# EAGLE design data board with PD (EAGLE 9.6.2)
COMPANY: ADAFRUIT INDUSTRIES; DRAWN: LADYADA; REV: A
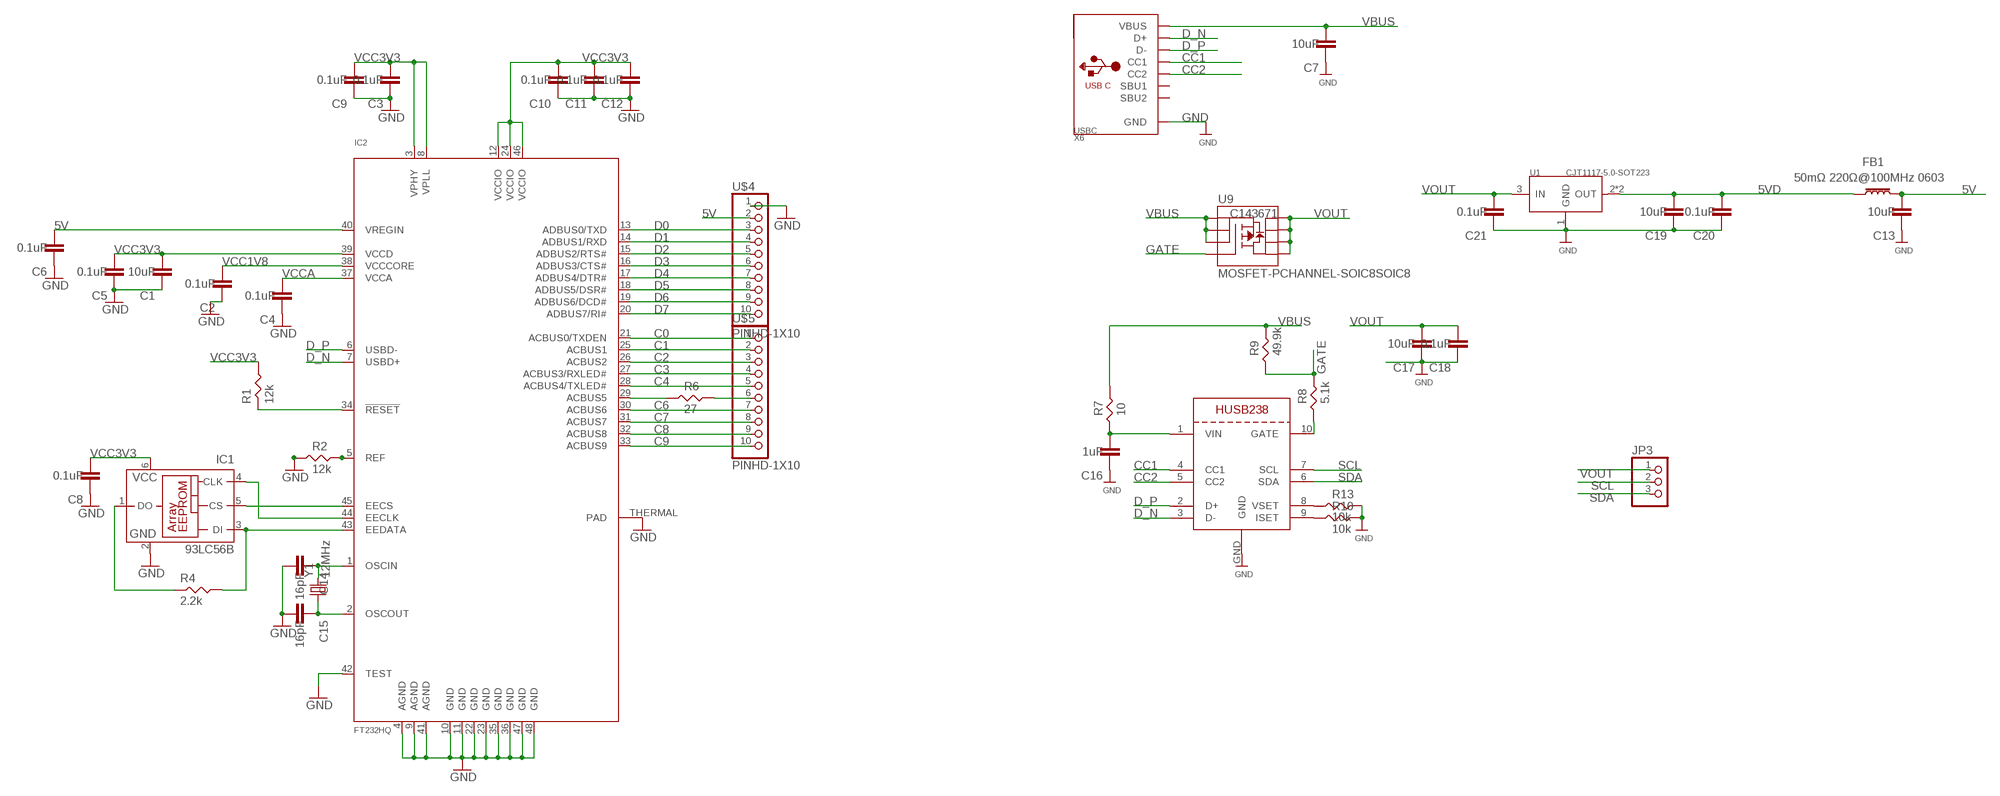
[diagram p0: schematic, sheet 1]

## Parts
C1  10uF  CAPACITOR_0805_N  [RESC0805_N]
C2  0.1uF  CAPACITOR_0402_N  [RESC0402_N]
C3  0.1uF  CAPACITOR_0402_N  [RESC0402_N]
C4  0.1uF  CAPACITOR_0402_N  [RESC0402_N]
C5  0.1uF  CAPACITOR_0402_N  [RESC0402_N]
C6  0.1uF  CAPACITOR_0402_N  [RESC0402_N]
C7  10uF  CAPACITOR_0805_N  [RESC0805_N]
C8  0.1uF  CAPACITOR_0402_N  [RESC0402_N]
C9  0.1uF  CAPACITOR_0402_N  [RESC0402_N]
C10  0.1uF  CAPACITOR_0402_N  [RESC0402_N]
C11  0.1uF  CAPACITOR_0402_N  [RESC0402_N]
C12  0.1uF  CAPACITOR_0402_N  [RESC0402_N]
C13  10uF  CAPACITOR_0805_N  [RESC0805_N]
C14  16pF  CAPACITOR_0402_N  [RESC0402_N]
C15  16pF  CAPACITOR_0402_N  [RESC0402_N]
C16  1uF  CAPACITOR_0402_N  [RESC0402_N]
C17  10uF  CAPACITOR_0805_N  [RESC0805_N]
C18  0.1uF  CAPACITOR_0402_N  [RESC0402_N]
C19  10uF  CAPACITOR_0805_N  [RESC0805_N]
C20  0.1uF  CAPACITOR_0402_N  [RESC0402_N]
C21  0.1uF  CAPACITOR_0402_N  [RESC0402_N]
FB1  50mΩ 220Ω@100MHz 0603  FERRITE_BEAD-0603  [0603]
IC1  93LC56B  93LC76A  [SOT23-6]
IC2  FT232HQ  [QFN48_8MM]
JP3  HEADER-1X3ROUND  [1X03_ROUND]
R1  12k  RES-0402  [RES-0402]
R2  12k  RES-0402  [RES-0402]
R4  2.2k  RES-0402  [RES-0402]
R6  27  RES-0402  [RES-0402]
R7  10  RES-0402  [RES-0402]
R8  5.1k  RES-0402  [RES-0402]
R9  49.9k  RES-0402  [RES-0402]
R10  10k  RES-0402  [RES-0402]
R13  10k  RES-0402  [RES-0402]
U1  CJT1117-5.0-SOT223  PMIC-CJT1117-5.0(SOT223)  [SOT-223]
U9  MOSFET-PCHANNEL-SOIC8SOIC8  [SO08]
U$4  PINHD-1X10  [1X10-BIG]
U$5  PINHD-1X10  [1X10-BIG]
X3  HUSB238  [DFN10_3X3MM]
X6  USBC  USB_C  [USB_C_CUSB31-CFM2AX-01-X]
Y1  12MHz  CRYSTALCRYSTAL-SMD-5X3-12MHZ  [CRYSTAL-SMD-5X3]

## Nets
5V [power]: C6.2 C13.2 FB1.2 IC2.40(VREGIN) U$4.2
5VD [power]: C19.2 C20.2 FB1.1 U1.2(OUT) U1.TER(OUT)
C0: IC2.21(ACBUS0/TXDEN) U$5.1
C1: IC2.25(ACBUS1) U$5.2
C2: IC2.26(ACBUS2) U$5.3
C3: IC2.27(ACBUS3/RXLED#) U$5.4
C4: IC2.28(ACBUS4/TXLED#) U$5.5
C6: IC2.30(ACBUS6) U$5.7
C7: IC2.31(ACBUS7) U$5.8
C8: IC2.32(ACBUS8) U$5.9
C9: IC2.33(ACBUS9) U$5.10
CC1: X3.4(CC1) X6.A5(CC1)
CC2: X3.5(CC2) X6.B5(CC2)
D0: IC2.13(ADBUS0/TXD) U$4.3
D1: IC2.14(ADBUS1/RXD) U$4.4
D2: IC2.15(ADBUS2/RTS#) U$4.5
D3: IC2.16(ADBUS3/CTS#) U$4.6
D4: IC2.17(ADBUS4/DTR#) U$4.7
D5: IC2.18(ADBUS5/DSR#) U$4.8
D6: IC2.19(ADBUS6/DCD#) U$4.9
D7: IC2.20(ADBUS7/RI#) U$4.10
D_N: IC2.7(USBD+) X3.3(D-) X6.A6(D+) X6.B6(D+)
D_P: IC2.6(USBD-) X3.2(D+) X6.A7(D-) X6.B7(D-)
GATE: R8.P$2 R9.P$1 U9.4(G)
GND: C1.1 C2.1 C3.1 C4.1 C5.1 C6.1 C7.1 C8.1 C9.1 C10.1 C11.1 C12.1 C13.1 C14.2 C15.2 C16.1 C17.1 C18.1 C19.1 C20.1 C21.1 IC1.2(GND) IC2.4(AGND) IC2.9(AGND) IC2.10(GND) IC2.11(GND) IC2.22(GND) IC2.23(GND) IC2.35(GND) IC2.36(GND) IC2.41(AGND) IC2.42(TEST) IC2.47(GND) IC2.48(GND) IC2.THERMAL(PAD) R2.P$1 R10.P$2 R13.P$2 U1.1(GND) U$4.1 X3.GND X6.A1B12(GND) X6.B1A12(GND)
N$1: IC2.5(REF) R2.P$2
N$2: C14.1 IC2.1(OSCIN) Y1.3
N$3: C15.1 IC2.2(OSCOUT) Y1.1
N$4: IC2.29(ACBUS5) R6.P$1
N$5: R6.P$2 U$5.6
N$6: C16.2 R7.P$1 X3.1(VIN)
N$7: IC2.34(!RESET) R1.P$1
N$8: R8.P$1 X3.10(GATE)
N$9: IC1.3(DI) IC2.43(EEDATA) R4.P$2
N$10: IC1.5(CS) IC2.45(EECS)
N$11: IC1.4(CLK) IC2.44(EECLK)
N$12: IC1.1(DO) R4.P$1
N$13: R13.P$1 X3.8(VSET)
N$14: R10.P$1 X3.9(ISET)
SCL: JP3.2 X3.7(SCL)
SDA: JP3.3 X3.6(SDA)
VBUS [power]: C7.2 R7.P$2 R9.P$2 U9.1(S) U9.2(S) U9.3(S) X6.A4B9(VBUS) X6.B4A9(VBUS)
VCC1V8: C2.2 IC2.38(VCCCORE)
VCC3V3: C1.2 C3.2 C5.2 C8.2 C9.2 C10.2 C11.2 C12.2 IC1.6(VCC) IC2.3(VPHY) IC2.8(VPLL) IC2.12(VCCIO) IC2.24(VCCIO) IC2.39(VCCD) IC2.46(VCCIO) R1.P$2
VCCA: C4.2 IC2.37(VCCA)
VOUT: C17.2 C18.2 C21.2 JP3.1 U1.3(IN) U9.5(D) U9.6(D) U9.7(D) U9.8(D)
Unconnected: X6.A8(SBU1) X6.B8(SBU2)

## Library data of the parts
C1-C21 = Nordic_nRF:CAPACITOR: Generic chip capacitor
FB1 = SparkFun-Coils:FERRITE_BEAD: Ferrite Bead (blocks, cores, rings, chokes, etc.) Inductor with layers of ferrite used to suppress high frequencies. Often used to isolate high frequency noise. SparkFun Products: IOIO-OTG - V2.2 <https://www.sparkfun.com/products/13613> SparkFun SAMD21 Mini Breakout <https://www.sparkfun.com/products/13664> SparkFun 6 Degrees of Freedom Breakout - LSM6DS3 <https://www.sparkfun.com/products/13339> SparkFun SAMD21 Dev Breakout <https://www.sparkfun.com/products/13672>; PROD_ID: NDUC-07859; VALUE: 30Ω/1.8A
IC1 = microchip:93*76?: 8K Microwire Compatible Serial EEPROM Source: http://ww1.microchip.com/downloads/en/DeviceDoc/21796H.pdf; MF: MICROCHIP; MPN: 93LC76AT-I/OT; OC_FARNELL: 1556170; OC_NEWARK: 61H6824
IC2 = microbuilder:FT232H
JP3 = microbuilder:HEADER-1X3: PIN HEADER
R1 R2 R4 R6-R10 R13 = FlashPCB_Resistors:RES-0402: https://www.digikey.com/en/products/filter/chip-resistor-surface-mount/52?s=N4IgjCBcpgbFoDGUBmBDANgZwKYBoQB7KAbRAGYBOAJgBZ4BdAgBwBcoQBlVgJwEsAdgHMQAX1EFqpEDxxY%2BWVoR4gGooA
U1 = Seeed-IC:PMIC-CJT1117-5.0(SOT223): 310030096; LCSC: C89273; MPN: CJT1117-5.0
U9 = SparkFun-DiscreteSemi:MOSFET-PCHANNEL-SOIC8: Generic 8-pin PMOSFET; LCSC: C143671
U$4 U$5 = adafruit:PINHD-1X10: Pin header 1x10 0.1" spacing With round pins
X3 = adafruit_power:HUSB238
X6 = microbuilder:USB_C: USB Type-C USB 2.0 Connector
Y1 = SparkFun-FreqCtrl:CRYSTAL: Various standard crystals. Proven footprints.; LCSC: C2901628; PROD_ID: XTAL-08297

## Net classes
1 power: width 0.305 mm
2 gnd: width 0.254 mm

## Board
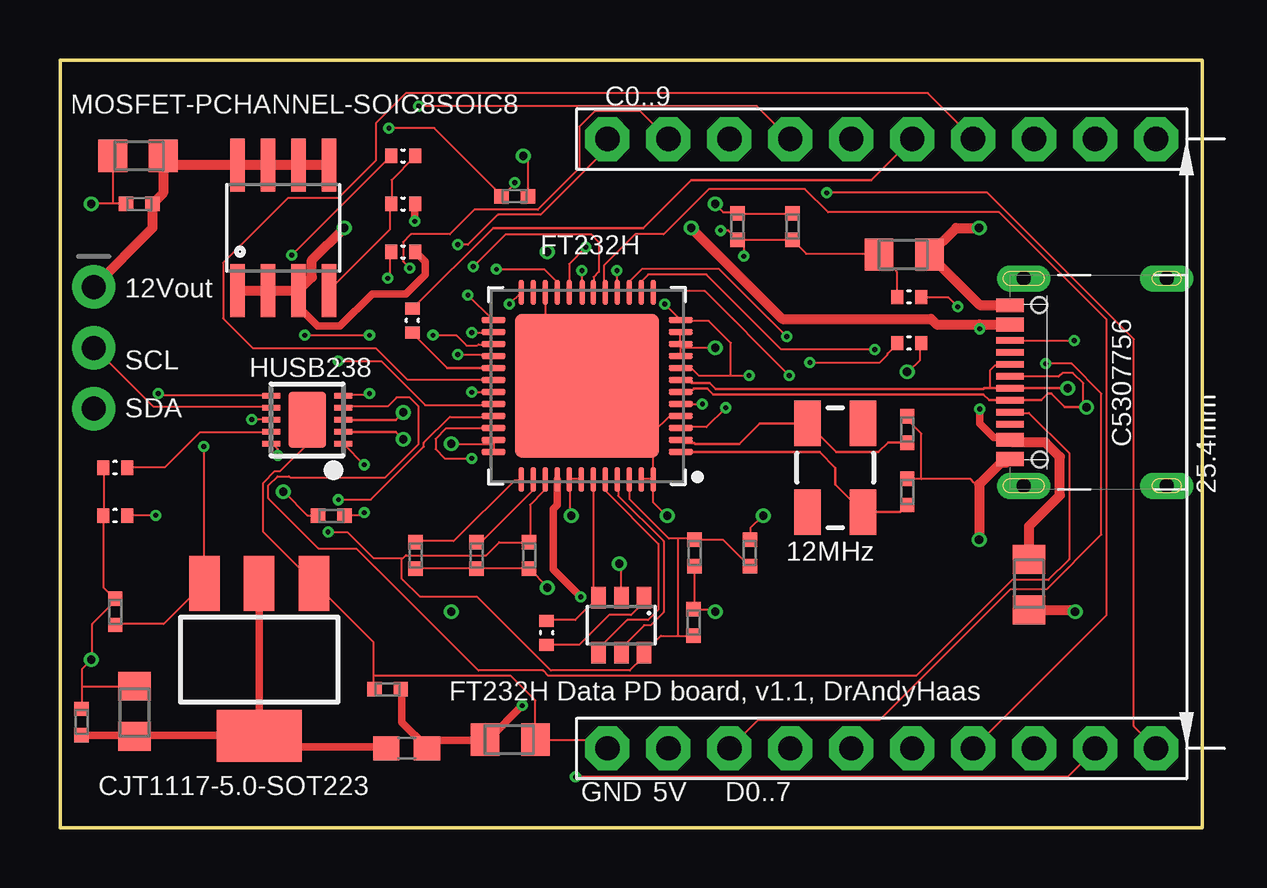
[diagram p1: board, top side]
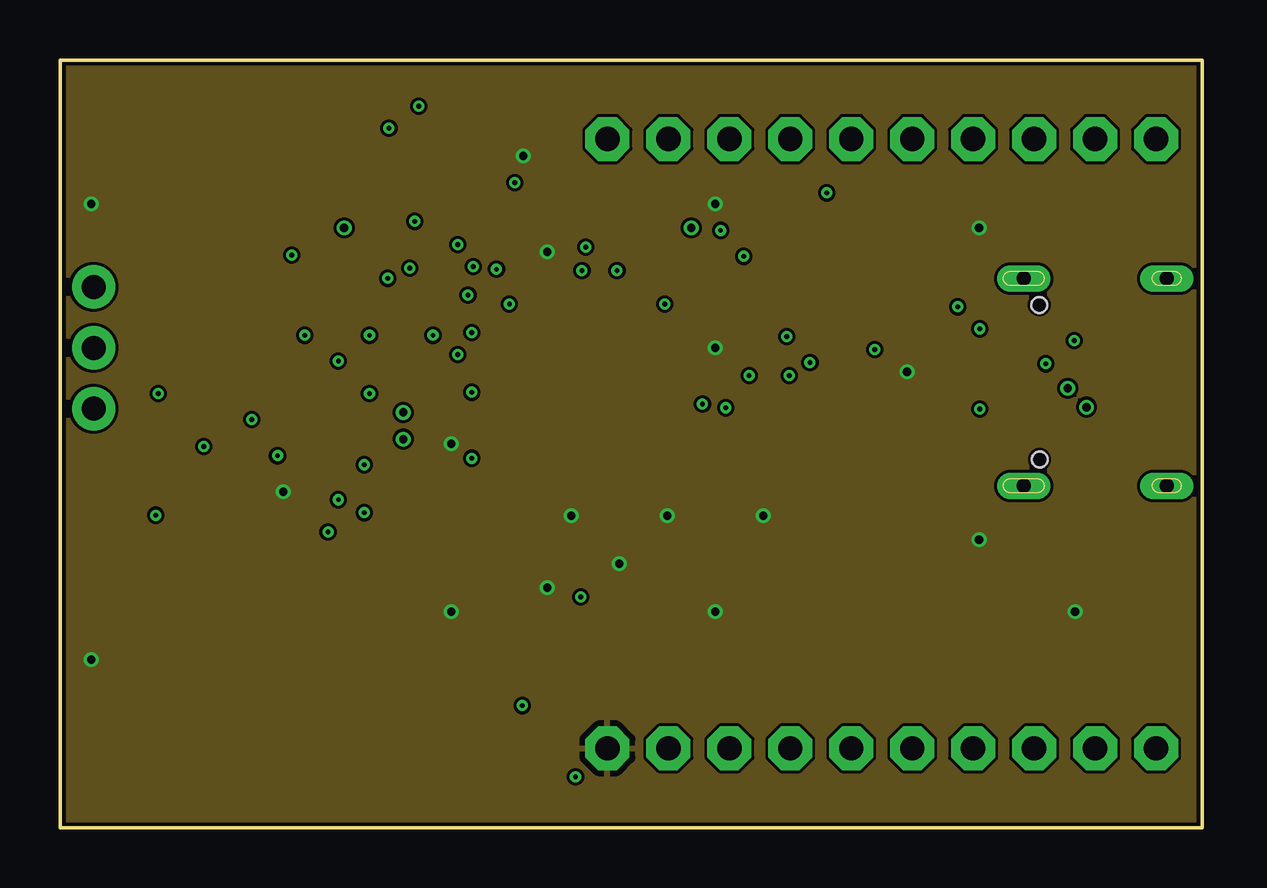
[diagram p2: board, inner layer GNDT]
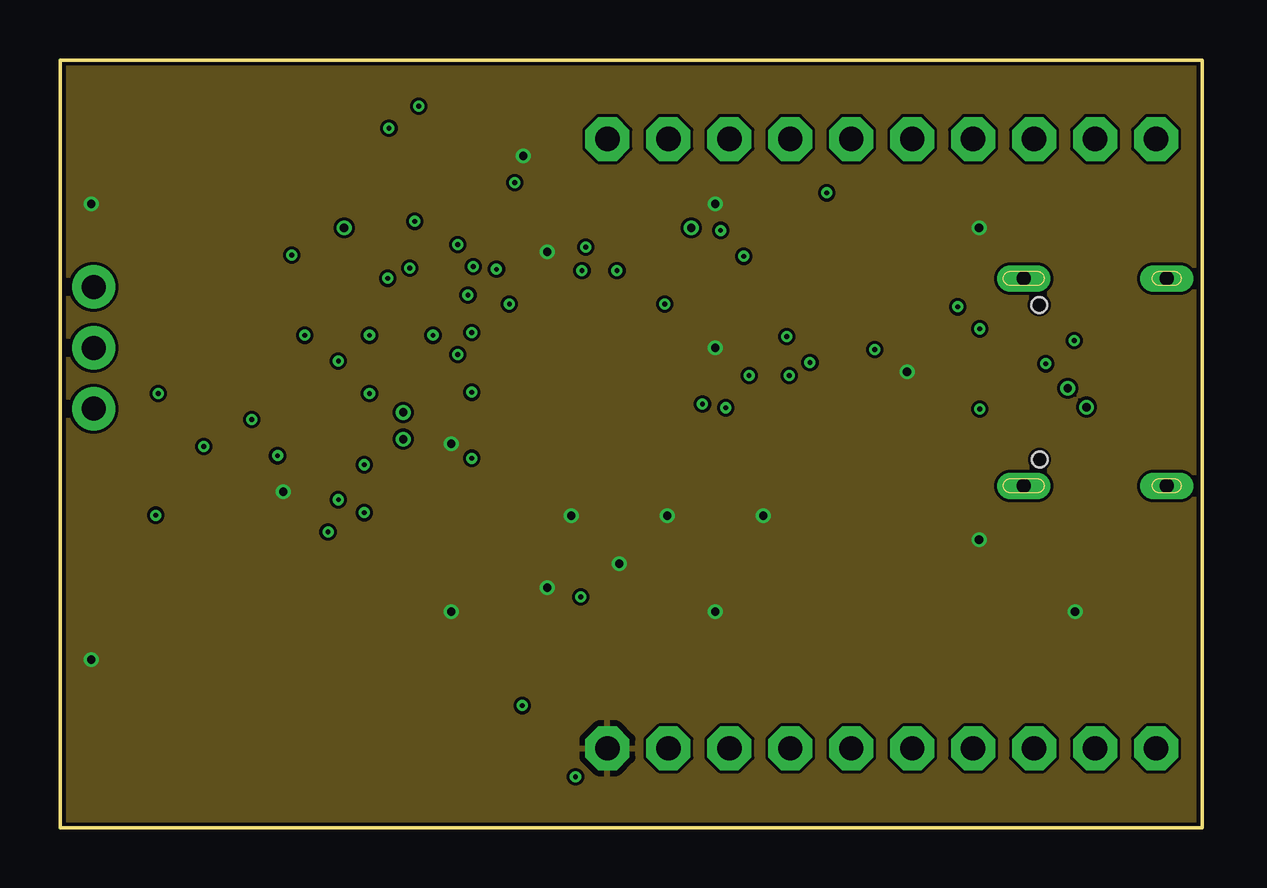
[diagram p3: board, inner layer GNDB]
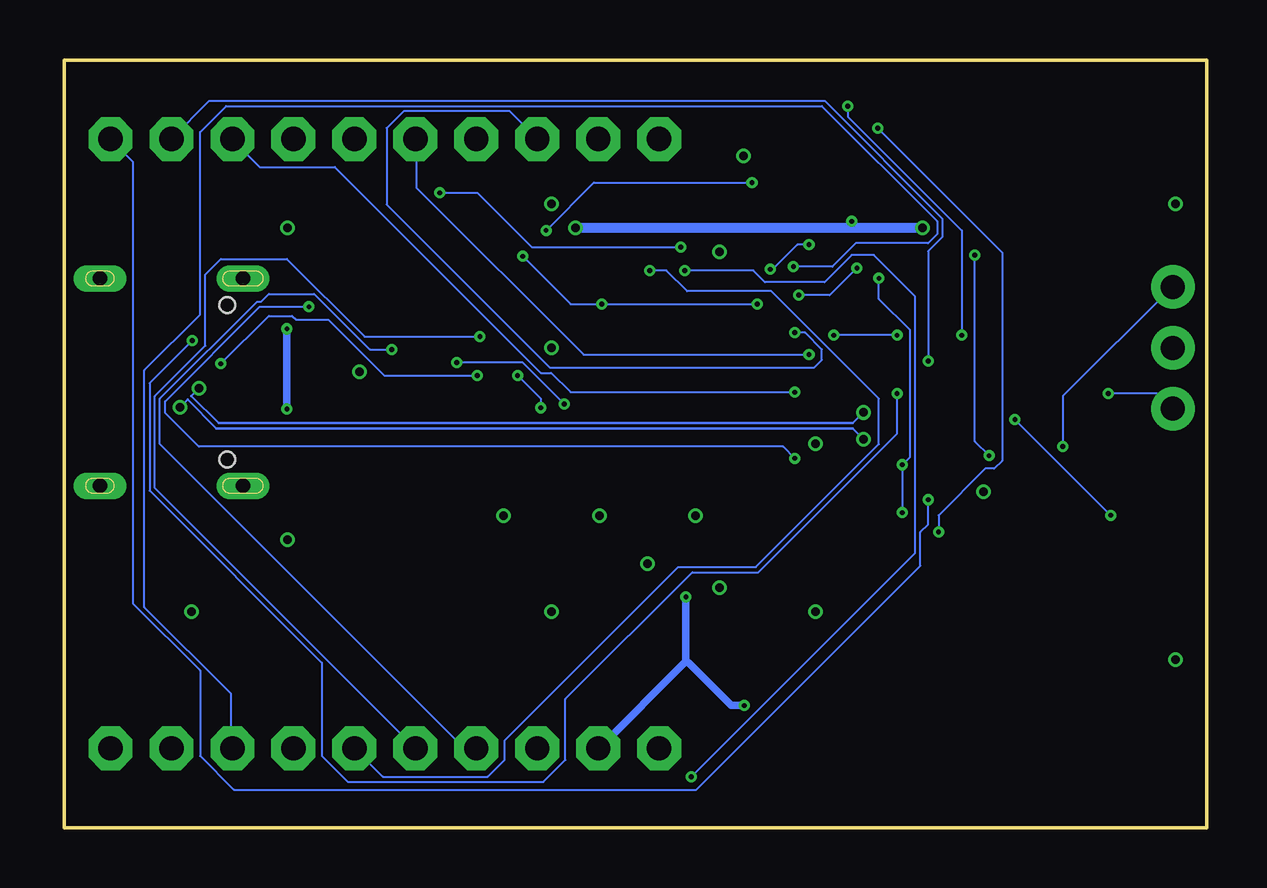
[diagram p4: board, bottom side, seen from below]

Size 47.6 x 32 mm. Coordinates in mm from the lower left corner, seen from the top.
Outline: 0,0 47.6,0 47.6,32 0,32 0,0
Copper layers (1+2*15+16): Top 0.035mm / dielectric 0.2mm / GNDT 0.0175mm / dielectric 1.065mm / GNDB 0.0175mm / dielectric 0.2mm / Bottom 0.035mm
Design rules "jlcpcb-4layers *": minimum track width 3.5mil, minimum drill 0.2mm, track to track 5mil, track to pad 0.2mm, pad to pad 5mil, via to via 0.5mm, smd to smd 5mil, copper to edge 0.15mm, drill to drill 6mil, minimum pad ring 10mil, minimum via ring 0.13mm, stop-mask expansion 0.05mm, vias tented up to drill 16mil, thermal gap 10mil

### Footprints (pad centres in the part's own frame; a part is rotated, then mirrored left to right if it is on the bottom)
RESC0805_N = smd 1.2 x 1.35: 1 -1.1,0; 2 1,0
RESC0402_N = smd 0.6 x 0.6: 1 -0.55,0; 2 0.55,0
0603 = smd 1.1 x 1: 1 -0.85,0; 2 0.85,0
SOT23-6 = smd 0.6 x 0.9: 1 -0.95,-1.15; 2 0,-1.15; 3 0.95,-1.15; 4 0.95,1.15; 5 0,1.15; 6 -0.95,1.15
QFN48_8MM = smd 1 x 0.23: 1 -3.9,2.75; 2 -3.9,2.25; 3 -3.9,1.75; 4 -3.9,1.25; 5 -3.9,0.75; 6 -3.9,0.25; 7 -3.9,-0.25; 8 -3.9,-0.75; 9 -3.9,-1.25; 10 -3.9,-1.75; 11 -3.9,-2.25; 12 -3.9,-2.75; 25 3.9,-2.75; 26 3.9,-2.25; 27 3.9,-1.75; 28 3.9,-1.25; 29 3.9,-0.75; 30 3.9,-0.25; 31 3.9,0.25; 32 3.9,0.75; 33 3.9,1.25; 34 3.9,1.75; 35 3.9,2.25; 36 3.9,2.75 | smd 0.23 x 1: 13 -2.75,-3.9; 14 -2.25,-3.9; 15 -1.75,-3.9; 16 -1.25,-3.9; 17 -0.75,-3.9; 18 -0.25,-3.9; 19 0.2,-3.9; 20 0.75,-3.9; 21 1.25,-3.9; 22 1.75,-3.9; 23 2.25,-3.9; 24 2.75,-3.9; 37 2.75,3.9; 38 2.25,3.9; 39 1.75,3.9; 40 1.25,3.9; 41 0.75,3.9; 42 0.25,3.9; 43 -0.25,3.9; 44 -0.75,3.9; 45 -1.25,3.9; 46 -1.75,3.9; 47 -2.25,3.9; 48 -2.75,3.9 | smd 6 x 6: THERMAL 0,0
1X03_ROUND = drill 1 pad 1.676: 1 -2.54,0; 2 0,0; 3 2.54,0
RES-0402 = smd 0.5 x 0.6: P$1 -0.5,0; P$2 0.5,0
SOT-223 = smd 1.27 x 2.286: 1 -2.286,-3.175; 2 0,-3.175; 3 2.286,-3.175 | smd 3.556 x 2.159: TER 0,3.175
SO08 = smd 0.61 x 2.21: 1 -1.905,-2.616; 2 -0.635,-2.616; 3 0.635,-2.616; 4 1.905,-2.616; 5 1.905,2.616; 6 0.635,2.616; 7 -0.635,2.616; 8 -1.905,2.616
1X10-BIG = drill 1.016 pad 1.778 octagon: 1 -11.43,0; 2 -8.89,0; 3 -6.35,0; 4 -3.81,0; 5 -1.27,0; 6 1.27,0; 7 3.81,0; 8 6.35,0; 9 8.89,0; 10 11.43,0
DFN10_3X3MM = smd 0.25 x 0.8: 1 -1,-1.5; 2 -0.5,-1.5; 3 0,-1.5; 4 0.5,-1.5; 5 1,-1.5; 6 1,1.5; 7 0.5,1.5; 8 0,1.5; 9 -0.5,1.5; 10 -1,1.5 | smd 2.35 x 1.58: GND 0,0
USB_C_CUSB31-CFM2AX-01-X = smd 0.575 x 1.15: A1B12 -3.2,3.545; A4B9 -2.4,3.545; B1A12 3.2,3.545; B4A9 2.4,3.545 | smd 0.275 x 1.15: A5 -1.25,3.545; A6 -0.25,3.545; A7 0.25,3.545; A8 1.25,3.545; B5 1.75,3.545; B6 0.75,3.545; B7 -0.75,3.545; B8 -1.75,3.545 | drill 0.6 pad 1 long: M1 -4.32,2.97; M2 4.32,2.97; M3 -4.32,-2.988; M4 4.32,-2.988 | hole 0.65: 3.22,2.32; -3.23,2.31
CRYSTAL-SMD-5X3 = smd 1.9 x 1.1: 1 -1.85,-1.15; 2 1.85,-1.15; 3 1.85,1.15; 4 -1.85,1.15

### Placement (x,y rotation side)
C1  35.13,23.89 180 top
C2  17.36,11.35 90 top
C3  28.74,11.45 270 top
C4  14.82,11.35 90 top
C5  28.23,25.05 270 top
C6  13.65,5.77 0 top
C7  40.38,10.17 90 top
C8  19.55,11.35 90 top
C9  18.95,26.32 180 top
C10  30.52,25.05 270 top
C11  26.44,11.45 90 top
C12  26.4,8.55 270 top
C13  18.71,3.66 180 top
C14  35.3,14 90 top
C15  35.3,16.6 90 top
C16  11.3,13 0 top
C17  3.3,28 0 top
C18  3.3,26 0 top
C19  3.1,4.8 270 top
C20  0.9,4.4 270 top
C21  2.3,9 270 top
FB1  14.45,3.31 0 top
IC1  23.39,8.44 180 top
IC2  21.96,18.41 180 top
JP3  1.4,20 270 top
R1  35.38,22.12 180 top
R2  35.38,20.2 180 top
R4  20.28,8.12 90 top
R6  14.68,21.14 90 top
R7  14.3,24 0 top
R8  14.3,28 0 top
R9  14.3,26 0 top
R10  2.3,15 180 top
R13  2.3,13 180 top
U1  8.3,7 180 top
U9  9.3,25 0 top
U$4  34.24,3.3 0 top
U$5  34.24,28.7 0 top
X3  10.3,17 90 top
X6  43.12,18.57 90 top
Y1  32.3,15 270 top

### Tracks (layer width: path | path; a pad name or v marks a point on that pad's centre or on a via)
5V  (via drill 0.2)
  Top 0.305: C6.2 14.25,5.73 14.25,4.38 15.27,3.36 FB1.2 15.38,3.47 15.54,3.63 17.7,3.63 C13.2 17.86,3.68 v19.27,5.08 | v21.7,9.62 20.56,10.75 20.56,13.29 20.72,13.45 20.72,14.48 IC2.40
  Bottom 0.305: 21.7,6.92 v21.7,9.62 | 21.7,6.92 25.31,3.3 U$4.2 | v19.27,5.08 19.8,5.08 21.59,6.87 21.7,6.92
5VD
  Top 0.305: C20.2 0.91,3.84 3.07,3.84 C19.2 3.24,3.84 8.15,3.84 U1.TER | FB1.1 13.54,3.36 8.74,3.36 8.31,3.79 U1.TER | U1.2 8.31,10.16 8.31,3.95 U1.TER
C0  (via drill 0.2)
  Top 0.089: v18.19,23.27 20.18,23.27 20.67,22.79 20.67,22.36 IC2.21 | v16.57,24.3 17,24.3 18.24,25.54 20.02,25.54 22.77,28.3 22.77,28.67 U$5.1
  Bottom 0.089: v18.19,23.27 18.08,23.27 17.05,24.3 v16.57,24.3
C1  (via drill 0.2)
  Top 0.089: v17,22.2 18.02,21.17 IC2.25 | v14.57,23.33 14.3,23.6 14.3,24.41 14.62,24.73 16.24,24.73 17.27,25.76 19.91,25.76 21.64,27.48 21.64,29.21 22.29,29.86 24.18,29.86 25.31,28.73 U$5.2
  Bottom 0.089: v17,22.2 15.7,22.2 v14.57,23.33
C2  (via drill 0.2)
  Top 0.089: v17.16,20.63 18.02,20.63 IC2.26
  Bottom 0.089: v17.16,20.63 16.73,20.63 16.03,19.93 16.03,19.5 16.35,19.17 27.36,19.17 34.16,25.97 34.16,29.16 33.46,29.86 29.04,29.86 27.9,28.73 U$5.3
C3  (via drill 0.2)
  Top 0.089: v15.54,20.52 16.51,20.52 16.95,20.09 17.38,20.09 17.43,20.14 18.02,20.14 IC2.27 | v10.2,20.52 v12.9,20.52 | v14.95,30.08 29.04,30.08 30.39,28.73 U$5.4
  Bottom 0.089: v12.9,20.52 v15.54,20.52 | v10.2,20.52 10.2,24.89 14.95,29.64 v14.95,30.08
C4  (via drill 0.2)
  Top 0.089: v16.57,19.71 18.02,19.71 IC2.28
  Bottom 0.089: v16.57,19.71 25.96,19.71 32.92,26.68 32.92,28.67 U$5.5
C6
  Top 0.089: IC2.30 18.02,18.69 14.46,18.69 13.17,19.98 8.04,19.98 6.8,21.22 6.8,23.55 9.5,26.24 11.6,26.24 13.17,27.81 13.17,29.37 14.41,30.62 36.16,30.62 38.05,28.73 U$5.7
C7  (via drill 0.2)
  Top 0.089: v17.16,18.15 18.02,18.15 IC2.31
  Bottom 0.089: v17.16,18.15 26.5,18.15 27.31,18.96 27.74,18.96 36.32,27.54 39.45,27.54 40.59,28.67 U$5.8
C8  (via drill 0.2)
  Top 0.089: v11.6,19.44 13.38,19.44 15.22,17.61 18.02,17.61 IC2.32
  Bottom 0.089: v11.6,19.44 11.6,24.03 11.01,24.62 11.01,25.38 15.92,30.29 41.56,30.29 43.12,28.73 U$5.9
C9  (via drill 0.2)
  Top 0.089: v11.6,13.67 12.95,13.67 15.16,15.88 15.16,16.04 16.24,17.12 18.02,17.12 IC2.33
  Bottom 0.089: v11.6,13.67 11.6,12.64 11.93,12.32 11.93,10.91 21.26,1.58 40.53,1.58 41.94,2.98 41.94,6.54 44.74,9.35 44.74,27.75 45.66,28.67 U$5.10
CC1
  Top 0.089: X3.4 11.82,17.55 13.65,17.55 14.03,17.93 14.57,17.93 14.95,17.55 14.95,15.99 13.54,14.59 9.6,14.59 9.55,14.64 9.06,14.64 8.69,14.26 8.69,13.72 10.79,11.62 12.36,11.62 17.43,6.54 20.13,6.54 20.34,6.33 35.67,6.33 39.67,10.32 41.18,10.32 42.04,11.19 42.04,15.61 40.37,17.28 39.61,17.28 X6.A5
CC2  (via drill 0.2)
  Top 0.089: v12.9,18.09 12.84,18.04 11.82,18.04 X3.5 | v42.26,20.31 39.61,20.31 X6.B5
  Bottom 0.089: v12.9,18.09 12.9,16.42 18.67,10.64 21.43,10.64 26.71,5.36 26.71,2.82 27.63,1.9 35.78,1.9 36.86,2.98 36.86,6.87 44.04,14.04 44.04,18.52 v42.26,20.31
D0  (via drill 0.2)
  Top 0.089: v30.39,18.85 26.88,22.36 24.72,22.36 IC2.13 | v41.07,19.34 42.15,19.34 43.39,18.09 43.39,12.21 41.13,9.94 39.61,9.94 34.16,4.49 29.09,4.49 27.9,3.3 U$4.3
  Bottom 0.089: v30.39,18.85 34.27,18.85 36.59,21.17 37.94,21.17 38.1,21.33 39.08,21.33 v41.07,19.34
D1  (via drill 0.2)
  Top 0.089: v33.95,19.93 30.06,19.93 26.93,23.06 24.5,23.06 24.23,22.79 24.23,22.36 IC2.14
  Bottom 0.089: v33.95,19.93 34.86,19.93 37.19,22.25 39.08,22.25 39.4,21.93 39.56,21.93 43.61,17.88 43.61,15.99 30.92,3.3 U$4.4
D2  (via drill 0.2)
  Top 0.089: v30.28,20.47 27.47,23.27 24.23,23.27 23.75,22.79 23.75,22.36 IC2.15
  Bottom 0.089: v30.28,20.47 35.08,20.47 38.32,23.71 41.07,23.71 41.72,23.06 41.72,20.09 43.82,17.98 43.82,14.15 U$4.5
D3  (via drill 0.2)
  Top 0.089: v23.21,23.22 23.21,22.36 IC2.16
  Bottom 0.089: v23.21,23.22 22.5,23.22 21.64,22.36 18.13,22.36 13.65,17.88 13.65,15.99 18.78,10.86 22.02,10.86 29.25,3.63 29.25,2.82 29.95,2.12 34.33,2.12 U$4.6
D4
  Top 0.089: IC2.17 22.67,22.36 22.67,23.44 23.96,24.73 25.15,24.73 27.04,26.62 31.03,26.62 32,25.65 39.13,25.65 43.61,21.17 43.61,8.86 U$4.7
D5  (via drill 0.2)
  Top 0.089: v17.21,23.38 18.56,24.73 22.13,24.73 22.45,24.41 22.45,23.17 22.23,22.95 22.23,22.36 IC2.18
  Bottom 0.089: v17.21,23.38 15.6,23.38 14.62,24.35 11.6,24.35 11.22,24.73 11.22,25.27 16.03,30.08 40.86,30.08 41.94,29 41.94,21.39 44.26,19.06 44.26,9.19 40.64,5.57 40.64,3.3 U$4.8
D6  (via drill 0.2)
  Top 0.089: v21.75,23.22 21.75,22.36 IC2.19 | v21.48,2.12 41.99,2.12 43.12,3.25 U$4.9
  Bottom 0.089: v21.75,23.22 18.89,23.22 18.4,22.73 15.92,22.73 14.79,23.87 13.87,23.87 12.14,22.14 12.14,11.45 v21.48,2.12
D7  (via drill 0.2)
  Top 0.089: v21.91,24.19 21.21,23.49 21.21,22.36 IC2.20 | v31.95,26.46 38.64,26.46 44.74,20.36 44.74,4.22 U$4.10
  Bottom 0.089: v21.91,24.19 28.12,24.19 30.39,26.46 v31.95,26.46
D_N  (via drill 0.35)
  Top 0.089: 38.75,18.32 38.75,19.06 38.97,19.28 39.56,19.28 X6.B6
  Top 0.102: IC2.7 26.2,18.66 26.32,18.55 26.32,18.54 26.33,18.53 27.07,18.53 27.32,18.28 38.47,18.28 38.51,18.32 38.75,18.32 X6.A6 40.98,18.32 v41.99,18.32 v41.99,18.31 | v14.3,17.3 14,17 X3.3
  Bottom 0.102: v14.3,17.3 14.74,16.86 41.16,16.86 42.3,18 v41.99,18.31
D_P  (via drill 0.35)
  Top 0.089: X6.A7 39.61,18.8 41.61,18.8 41.77,18.96 42.2,18.96 42.64,18.52 42.64,17.55 v42.77,17.53
  Top 0.102: IC2.6 26.29,18.16 26.4,18.27 26.4,18.29 26.41,18.3 26.98,18.3 27.22,18.05 38.48,18.05 38.71,17.82 X6.B7 40.88,17.82 41.15,18.09 41.3,18.09 41.86,17.53 v42.77,17.53 | v14.3,16.2 14,16.5 X3.2
  Bottom 0.102: v14.3,16.2 14.74,16.64 41.26,16.64 42.46,17.84 v42.77,17.53
GATE
  Top 0.089: R8.P$2 14.79,27.97 13.81,27 13.81,26.03 R9.P$1 13.76,25.97 13.76,24.95 11.22,22.41 U9.4
GND  (via drill 0.35)
  Top 0.089: 13.06,6.33 13.06,7.73 10.63,10.16 U1.1 10.58,10.21 8.47,12.32 8.47,14.37 8.96,14.86 9.17,14.86 10.25,15.93 10.25,16.96 X3.GND | 13.06,6.33 13.06,5.79 C6.1 | IC2.23 19.75,22.36 20.18,22.36 IC2.22 20.24,22.3 20.24,20.14 IC2.THERMAL 22.02,18.36 22.88,18.36 24.74,16.5 | IC2.47 24.23,14.53 24.66,14.53 IC2.48 | 24.74,16.5 24.72,16.47 24.72,14.53 IC2.48 | 24.74,16.5 25.37,17.12 25.85,17.12 IC2.4 | C4.1 14.84,10.81 17.32,10.81 C2.1 17.38,10.81 19.54,10.81 C8.1 19.59,10.75 20.29,10.05 v20.3,10 | 25.85,19.98 25.85,20.14 IC2.10 25.85,20.2 25.85,20.63 IC2.11 | 25.85,19.98 25.85,19.71 IC2.9 | R10.P$2 1.83,14.96 1.83,13.02 R13.P$2 1.83,12.97 1.83,10 2.26,9.56 C21.1 2.26,9.51 2.26,9.4 1.35,8.49 1.35,7.03 v1.3,7 1.29,6.97 0.91,6.6 0.91,5.89 | 18.08,15.99 18.08,16.15 IC2.35 | 18.08,15.99 18.08,15.66 IC2.36 | IC2.42 21.7,14.53 21.26,14.53 IC2.41 21.26,14.48 21.26,13.02 v21.3,13 | 0.91,5.89 0.91,4.98 C20.1 | C16.1 10.74,13.02 10.31,13.02 9.33,13.99 v9.3,14 | 2.21,26.03 1.35,26.03 v1.3,26 | 2.21,26.03 2.75,26.03 C18.1 | v27.3,9 27.25,9.03 27.2,9.08 26.44,9.08 C12.1 26.44,9.13 26.44,10.86 C11.1 | C9.1 19.48,26.35 19.48,27.81 19.32,27.97 v19.3,28 | C3.1 28.77,12.05 28.77,12.48 29.25,12.97 v29.3,13 | 35.89,14.53 37.94,14.53 38.1,14.37 38.3,14.3 | 35.89,14.53 35.35,14.53 C14.2 | 35.89,14.53 35.89,16.42 35.35,16.96 35.35,17.12 C15.2 | R2.P$1 35.84,20.14 35.84,19.5 35.35,19.01 v35.3,19 | v27.3,26 27.31,25.97 27.63,25.65 28.23,25.65 C5.1 28.28,25.6 30.49,25.6 C10.1 | IC1.2 23.37,9.62 23.37,10.91 23.31,10.97 v23.3,11 | 18.08,15.99 16.35,15.99 v16.3,16 | 25.85,19.98 27.25,19.98 v27.3,20
  Top 0.089: 2.21,26.03 2.21,27.97 C17.1 | U$4.1 22.77,3.3 22.45,3.63 19.86,3.63 C13.1 19.8,3.68 19.8,5.3 18.78,6.33 13.06,6.33 | 0.91,5.89 3.07,5.89 C19.1 | IC2.48 24.72,14.48 24.72,13.56 25.26,13.02 v25.3,13
  Top 0.406: X6.B1A12 38.34,21.77 C1.1 37.34,25 v38.3,25 | X6.A1B12 39.42,15.21 39.2,15.21 38.3,14.3 v38.3,12 | C7.1 42.23,9.07 v42.3,9
  other vias: 16.3,9 20.3,24
  pour GNDT: -1.7,32.99 49.4,32.99 49.4,-0.9 -1.7,-0.9
  pour GNDB: -0.7,31.85 48.4,31.85 48.4,-1.27 -0.7,-1.27
N$1  (via drill 0.2)
  Top 0.089: v31.25,19.39 34.16,19.39 34.49,19.71 34.49,19.77 34.86,20.14 R2.P$2 | v26.77,17.66 25.91,17.66 IC2.5
  Bottom 0.089: v31.25,19.39 28.5,19.39 v26.77,17.66
N$2
  Top 0.102: IC2.1 30.48,15.66 30.5,15.65 31.65,15.65 32.3,15 32.3,14.3 Y1.3 35,13.15 C14.1
N$3
  Top 0.102: IC2.2 26,16.03 26.44,16.03 26.46,16 28.3,16 29.15,16.85 Y1.1 32.35,15.65 34.1,15.65 34.5,16.05 C15.1
N$4
  Top 0.102: IC2.29 16.14,19.16 14.68,20.62 R6.P$1
N$5
  Top 0.102: R6.P$2 18.05,25 24.3,25 26.3,27 33.81,27 U$5.6
N$6  (via drill 0.2)
  Top 0.089: v12.68,13.13 12.57,13.02 11.87,13.02 C16.2 | v12.68,15.12 11.82,15.99 X3.1 | v13.65,22.9 13.76,23.01 13.76,23.98 R7.P$1
  Bottom 0.089: v12.68,13.13 v12.68,15.12 12.36,15.45 12.36,20.74 13.65,22.03 v13.65,22.9
N$7  (via drill 0.2)
  Top 0.089: v37.4,21.71 37.02,22.09 35.89,22.09 R1.P$1 | v17.16,15.39 16.03,15.39 15.65,15.77 15.65,16.2 16.08,16.64 18.02,16.64 IC2.34
  Bottom 0.089: v37.4,21.71 39.45,21.71 43.39,17.77 43.39,17.28 41.99,15.88 17.65,15.88 v17.16,15.39
N$8  (via drill 0.2)
  Top 0.089: v9.66,23.87 13.76,27.97 R8.P$1 | v9.06,15.5 9.06,15.77 8.85,15.99 X3.10
  Bottom 0.089: v9.66,23.87 9.66,16.1 v9.06,15.5
N$9
  Top 0.089: R4.P$2 20.29,8.65 21.48,8.65 22.4,9.56 IC1.3 22.4,9.62 22.23,9.78 22.23,14.48 IC2.43
N$10
  Top 0.089: IC1.5 23.42,7.3 23.42,7.51 24.34,8.43 24.61,8.43 25.15,8.97 25.15,11.94 23.26,13.83 23.26,14.48 IC2.45
N$11
  Top 0.089: IC1.4 22.45,7.46 23.64,8.65 24.5,8.65 24.93,9.08 24.93,11.83 22.72,14.04 22.72,14.48 IC2.44
N$12
  Top 0.089: R4.P$1 21.64,7.62 22.88,8.86 23.8,8.86 24.29,9.35 24.29,9.56 IC1.1
N$13  (via drill 0.2)
  Top 0.089: v3.99,13.02 2.8,13.02 R13.P$1 | v7.99,17.01 8.8,17.01 X3.8
  Bottom 0.089: v7.99,17.01 v3.99,13.02
N$14
  Top 0.089: R10.P$1 2.8,15.02 4.37,15.02 5.83,16.47 8.8,16.47 X3.9
SCL
  Top 0.089: X3.7 8.8,17.55 3.88,17.55 1.45,19.98 JP3.2
SDA  (via drill 0.2)
  Top 0.089: v4.1,18.09 4.15,18.04 8.8,18.04 X3.6
  Bottom 0.089: v4.1,18.09 2.05,18.09 1.45,17.5 JP3.3
VBUS  (via drill 0.2, 0.35)
  Top 0.305: R7.P$2 14.84,23.98 15.22,23.6 15.22,23.06 14.41,22.25 13.01,22.25 11.66,20.9 10.74,20.9 9.98,21.66 9.98,22.2 U9.3 | v14.79,25.27 14.79,25.97 R9.P$2 | v38.32,17.45 38.32,16.85 38.91,16.26 39.4,16.26 X6.A4B9 | v38.32,20.79 38.32,20.97
  Top 0.406: U9.1 U9.2 U9.3 10.5,22.95 10.5,23.66 v11.84,25 | v26.3,25 30.1,21.2 36.3,21.2 36.53,20.97 38.32,20.97 X6.B4A9 | X6.A4B9 39.69,16.06 41.05,16.06 41.67,15.45 41.67,13.85 40.38,12.56 C7.2
  Bottom 0.305: v14.79,25.27 14.79,25 | v38.32,20.79 v38.32,17.45
  Bottom 0.406: v11.84,25 14.79,25 v26.3,25
VCC1V8
  Top 0.089: C2.2 17.38,11.94 17.59,11.94 19.7,14.04 19.7,14.48 IC2.38
VCC3V3  (via drill 0.2)
  Top 0.089: IC2.39 20.18,14.48 20.18,14.04 19.59,13.45 19.59,11.94 C8.2 19.54,11.89 18.29,11.89 17.75,11.35 14.41,11.35 14.27,11.21 | 25.74,8 25.04,8 IC1.6 24.29,7.24 24.29,7.08 23.75,6.54 20.45,6.54 17.38,9.62 15,9.62 14.25,10.38 14.25,11.19 14.27,11.21 | 25.74,8 C12.2 | C3.2 28.71,10.91 27.63,11.99 C11.2 26.39,12.05 25.74,12.05 | 25.74,12.05 25.37,12.05 23.75,13.67 23.75,14.48 IC2.46 | 25.74,12.05 25.74,8 | v27.74,17.5 26.93,16.69 25.91,16.69 IC2.3 | 27.96,18.85 26.61,18.85 26.34,19.12 25.91,19.12 IC2.8 | 27.96,18.85 v28.71,18.85 | 27.96,18.85 27.96,20.2 27.04,21.12 25.91,21.12 IC2.12 v25.2,21.82 | v18.73,21.82 IC2.24 | R1.P$2 34.86,22.14 34.86,23.17 34.16,23.87 C1.2 34.11,23.92 31.09,23.92 30.55,24.46 C10.2 30.49,24.52 28.5,24.52 | v18.94,26.89 18.94,26.84 18.46,26.35 C9.2 18.4,26.35 15.6,29.16 v13.71,29.16 | v27.52,24.89 27.85,24.89 28.23,24.52 C5.2 | 28.5,24.52 28.28,24.52 C5.2 | 28.5,24.52 v28.5,23.81 | 28.5,24.52 C5.2 | v11.17,12.32 11.98,12.32 13.06,11.24 14.25,11.24 14.27,11.21
  Bottom 0.089: v27.74,17.5 27.74,17.88 v28.71,18.85 | v18.73,21.82 v25.2,21.82 26.5,21.82 v28.5,23.81 | v18.94,26.89 25.53,26.89 v27.52,24.89 | v11.17,12.32 11.17,13.02 9.23,14.96 8.85,14.96 8.53,15.29 8.53,23.98 v13.71,29.16
VCCA
  Top 0.089: C4.2 14.84,11.94 16.41,11.94 18.94,14.48 19.21,14.48 IC2.37
VOUT  (via drill 0.2)
  Top 0.089: C21.2 2.32,8.49 4.32,8.49 5.99,10.16 U1.3 5.99,10.21 v5.99,15.88
  Top 0.406: U9.5 U9.6 U9.7 U9.8 4.68,27.62 C17.2 4.3,26.45 C18.2 3.85,24.99 JP3.1
  Bottom 0.089: v5.99,15.88 5.99,17.98 1.45,22.52 JP3.1

### Text on the board
tPlace: C0..9 | FT232H | 12Vout | SCL | SDA | FT232H Data PD board, v1.1, DrAndyHaas | GND | 5V | D0..7